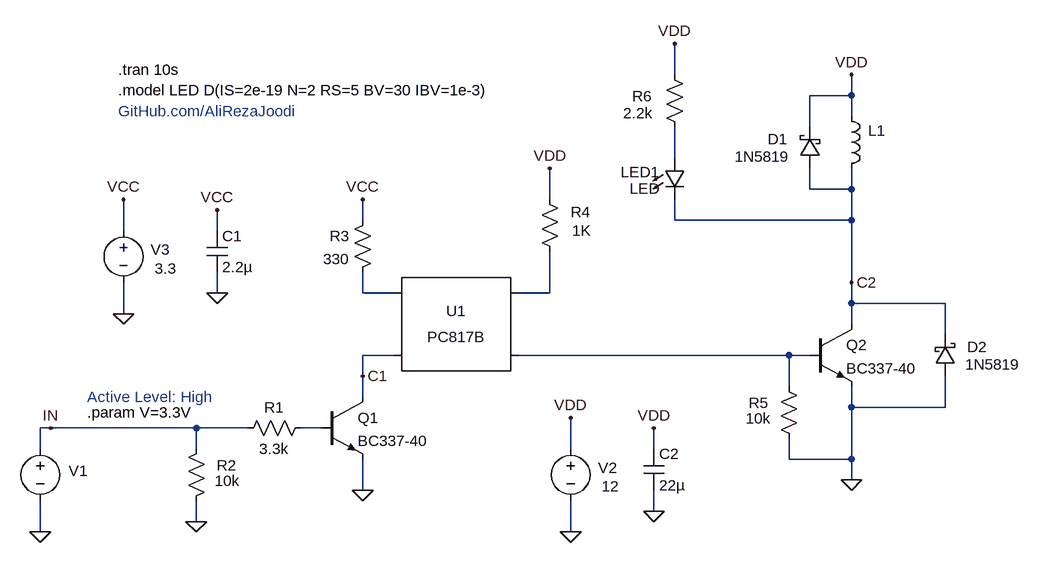
[diagram p0: schematic v3.0.asc]
v3.0.asc, the LTspice schematic file:
Version 4.1
SHEET 1 1332 680
WIRE 560 -208 560 -256
WIRE 832 -176 832 -208
WIRE 832 -176 768 -176
WIRE 832 -144 832 -176
WIRE 768 -128 768 -176
WIRE 560 -80 560 -128
WIRE 768 -32 768 -64
WIRE 832 -32 832 -64
WIRE 832 -32 768 -32
WIRE 368 -16 368 -64
WIRE 80 16 80 -16
WIRE 560 16 560 -16
WIRE 832 16 832 -32
WIRE 832 16 560 16
WIRE -288 32 -288 -16
WIRE -144 32 -144 0
WIRE 832 112 832 16
WIRE -144 128 -144 96
WIRE 80 128 80 96
WIRE 128 128 80 128
WIRE 368 128 368 64
WIRE 368 128 320 128
WIRE 832 144 832 112
WIRE 976 144 832 144
WIRE -288 160 -288 112
WIRE 832 176 832 144
WIRE 976 192 976 144
WIRE 128 224 80 224
WIRE 736 224 320 224
WIRE 768 224 736 224
WIRE 80 256 80 224
WIRE 736 272 736 224
WIRE 80 288 80 256
WIRE 832 304 832 272
WIRE 976 304 976 256
WIRE 976 304 832 304
WIRE -400 336 -416 336
WIRE -176 336 -400 336
WIRE -96 336 -176 336
WIRE 16 336 -16 336
WIRE -416 368 -416 336
WIRE -176 368 -176 336
WIRE 400 368 400 320
WIRE 528 368 528 336
WIRE 736 384 736 352
WIRE 832 384 832 304
WIRE 832 384 736 384
WIRE 832 416 832 384
WIRE 80 432 80 384
WIRE 528 464 528 432
WIRE -176 480 -176 448
WIRE -416 496 -416 448
WIRE 400 496 400 448
FLAG 80 432 0
FLAG -416 496 0
FLAG 400 496 0
FLAG -400 336 IN
FLAG 832 416 0
FLAG 400 320 VDD
FLAG 368 -64 VDD
FLAG 832 -208 VDD
FLAG 832 112 C2
FLAG 560 -256 VDD
FLAG -288 160 0
FLAG -288 -16 VCC
FLAG 80 -16 VCC
FLAG -144 128 0
FLAG -144 0 VCC
FLAG 528 464 0
FLAG 528 336 VDD
FLAG 80 256 C1
FLAG -176 480 0
SYMBOL Optos\\PC817B 224 176 R0
SYMATTR InstName U1
SYMBOL res 352 -32 R0
WINDOW 0 48 35 Left 2
WINDOW 3 50 64 Left 2
SYMATTR InstName R4
SYMATTR Value 1K
SYMBOL voltage -416 352 R0
WINDOW 123 0 0 Left 0
WINDOW 39 0 0 Left 0
WINDOW 0 44 50 Left 2
WINDOW 3 44 78 Invisible 2
SYMATTR InstName V1
SYMATTR Value PULSE(0 {V} 2 1n 1n 2 4)
SYMBOL res 96 0 M0
SYMATTR InstName R3
SYMATTR Value 330
SYMBOL voltage 400 352 R0
WINDOW 123 0 0 Left 0
WINDOW 39 0 0 Left 0
WINDOW 0 42 45 Left 2
WINDOW 3 48 74 Left 2
SYMATTR InstName V2
SYMATTR Value 12
SYMBOL npn 768 176 R0
SYMATTR InstName Q2
SYMATTR Value BC337-40
SYMBOL res 720 256 R0
WINDOW 0 -46 41 Left 2
WINDOW 3 -51 65 Left 2
SYMATTR InstName R5
SYMATTR Value 10k
SYMBOL ind 816 -160 R0
WINDOW 3 39 80 Invisible 2
WINDOW 0 42 38 Left 2
SYMATTR Value 25m
SYMATTR InstName L1
SYMATTR SpiceLine Rser=100
SYMBOL res 544 -224 R0
WINDOW 0 -49 49 Left 2
WINDOW 3 -63 75 Left 2
SYMATTR InstName R6
SYMATTR Value 2.2k
SYMBOL schottky 784 -64 R180
WINDOW 0 50 45 Left 2
WINDOW 3 47 18 Left 2
SYMATTR InstName D1
SYMATTR Value 1N5819
SYMBOL npn 16 288 R0
SYMATTR InstName Q1
SYMATTR Value BC337-40
SYMBOL voltage -288 16 R0
WINDOW 123 0 0 Left 0
WINDOW 39 0 0 Left 0
WINDOW 0 42 45 Left 2
WINDOW 3 48 74 Left 2
SYMATTR InstName V3
SYMATTR Value 3.3
SYMBOL res -112 352 R270
WINDOW 0 32 56 VTop 2
WINDOW 3 0 56 VBottom 2
SYMATTR InstName R1
SYMATTR Value 3.3k
SYMBOL cap -160 32 R0
SYMATTR InstName C1
SYMATTR Value 2.2µ
SYMBOL cap 512 368 R0
SYMATTR InstName C2
SYMATTR Value 22µ
SYMBOL res -160 352 M0
WINDOW 0 -46 41 Left 2
WINDOW 3 -51 65 Left 2
SYMATTR InstName R2
SYMATTR Value 10k
SYMBOL LED 544 -80 R0
WINDOW 0 -67 22 Left 2
WINDOW 3 -53 47 Left 2
SYMATTR InstName LED1
SYMATTR Value LED
SYMBOL schottky 960 256 M180
WINDOW 0 50 45 Left 2
WINDOW 3 47 18 Left 2
SYMATTR InstName D2
SYMATTR Value 1N5819
TEXT -296 -216 Left 2 !.tran 10s
TEXT -344 288 Left 2 ;Active Level: High
TEXT -296 -184 Left 2 !.model LED D(IS=2e-19 N=2 RS=5 BV=30 IBV=1e-3)
TEXT -296 -152 Left 2 ;GitHub.com/AliRezaJoodi
TEXT -344 312 Left 2 !.param V=3.3V

The netlist it stands for:
* v3.0.asc
X§U1 N002 C1 N003 N004 PC817 Igain=1.5m
R4 VDD N003 1K
V1 IN 0 PULSE(0 {V} 2 1n 1n 2 4)
R3 VCC N002 330
V2 VDD 0 12
Q2 C2 N004 0 0 BC337-40
R5 N004 0 10k
L1 VDD C2 25m Rser=100
R6 VDD N001 2.2k
D1 C2 VDD 1N5819
Q1 C1 N005 0 0 BC337-40
V3 VCC 0 3.3
R1 IN N005 3.3k
C1 VCC 0 2.2µ
C2 VDD 0 22µ
R2 IN 0 10k
D§LED1 N001 C2 LED
D2 0 C2 1N5819
.model D D
.lib standard.dio
.model NPN NPN
.model PNP PNP
.lib standard.bjt
.tran 10s
* Active Level: High
.model LED D(IS=2e-19 N=2 RS=5 BV=30 IBV=1e-3)
* GitHub.com/AliRezaJoodi
.param V=3.3V
.lib PC817.sub
.backanno
.end